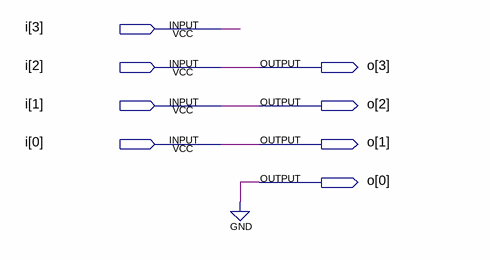
[diagram p0: schematic sheet]
// Quartus schematic multi2.bdf as structural Verilog: 0 symbols, 8 pins
module multi2 (
  input  [3:0] i,
  output [3:0] o
);


  assign o = {i[2:0], 1'b0};
endmodule
